# EAGLE design picopower (EAGLE 9.5.1)
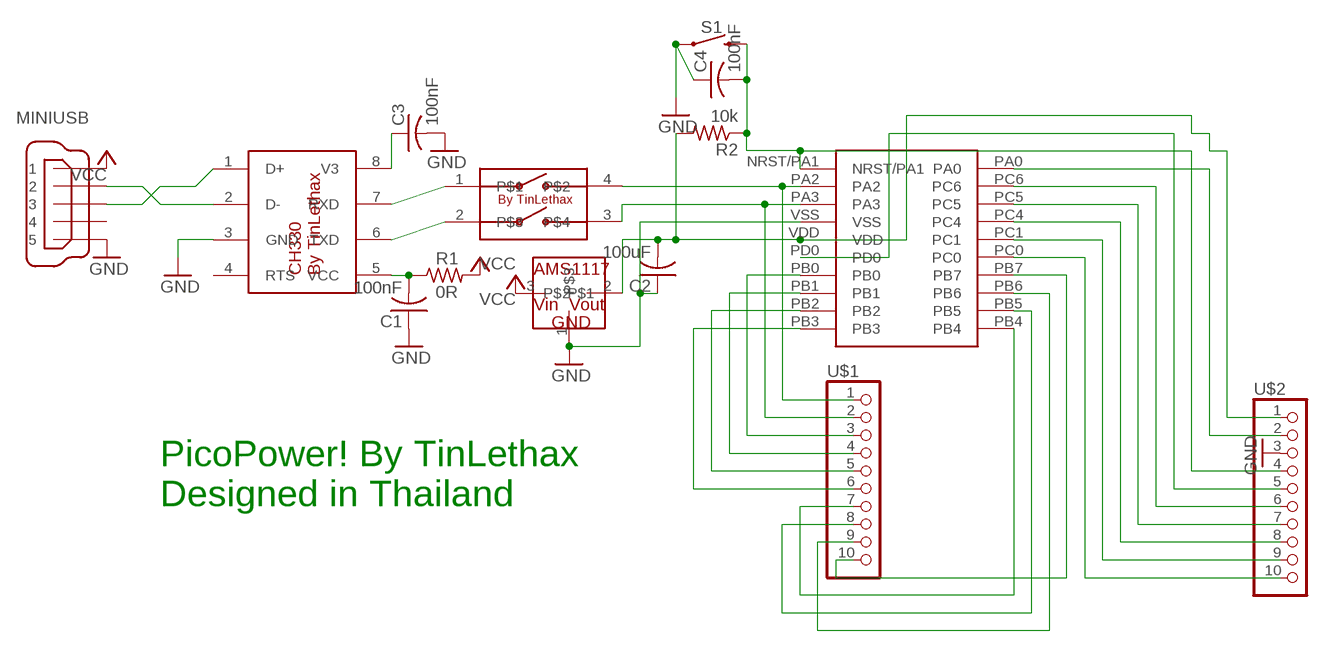
[diagram p0: schematic, sheet 1]

## Parts
2DIP  2DIPSWITCH  [SOIC127P835X230-4N]
C1  100nF  C-USC0603K  [C0603K]
C2  100uF  C-USC0603K  [C0603K]
C3  100nF  C-USC0603K  [C0603K]
C4  100nF  C-USC0603K  [C0603K]
CH330  CH330  [SOIC127P600X150-8N]
MINIUSB  MINI-USB-UX60A-MB-5ST  [UX60A-MB-5ST]
R1  0R  R-US_R0603  [R0603]
R2  10k  R-US_R0603  [R0603]
S1  MOMENTARY-SWITCH-SPST-SMD-6.0X3.5MM  [TACTILE_SWITCH_SMD_6.0X3.5MM]
STM8L  STM8L151F3  [UFQFPN-20]
U$1  PINHD-1X10  [1X10-BIG]
U$2  PINHD-1X10  [1X10-BIG]
U$3  AMS1117  [SOT223]

## Nets
GND: C1.1 C2.1 C3.2 C4.1 CH330.3(GND) MINIUSB.5 S1.1 STM8L.VSS U$2.3 U$3.1
N$1: 2DIP.1 CH330.7(RXD)
N$2: 2DIP.2 CH330.6(TXD)
N$3: 2DIP.4 STM8L.PA2 U$1.1
N$4: 2DIP.3 STM8L.PA3 U$1.2
N$5: C1.2 CH330.5(VCC) R1.1
N$6: C3.1 CH330.8(V3)
N$7: C2.2 R2.2 STM8L.VDD U$2.1 U$3.2
N$8: STM8L.PB0 U$1.3
N$9: STM8L.PB1 U$1.4
N$10: STM8L.PB2 U$1.5
N$11: STM8L.PB3 U$1.6
N$12: STM8L.PB4 U$1.7
N$13: STM8L.PB5 U$1.8
N$14: STM8L.PB6 U$1.9
N$15: STM8L.PB7 U$1.10
N$16: STM8L.PC0 U$2.10
N$17: STM8L.PC1 U$2.9
N$18: STM8L.PC4 U$2.8
N$19: STM8L.PC5 U$2.7
N$20: STM8L.PC6 U$2.6
N$21: CH330.2(D-) MINIUSB.2
N$22: C4.2 R2.1 S1.2 STM8L.NRST/PA1 U$2.4
N$23: STM8L.PA0 U$2.2
N$24: STM8L.PD0 U$2.5
N$25: CH330.1(D+) MINIUSB.3
VCC: MINIUSB.1 R1.2 U$3.3
Unconnected: CH330.4(RTS) MINIUSB.4

## Notes on the sheet
- PicoPower! By TinLethax
  Designed in Thailand

## Library data of the parts
2DIP = KE_DIP_SWITCH_2:2DIPSWITCH: Shenzhen Ke Rotary Dip Switch (x2); PACKAGE: SOP4
C1-C4 = adafruit:C-US: CAPACITOR, American symbol
CH330 = CH330:CH330: CH330 Super small Serial to USB chip; DESCRIPTION: CH330 Super small Serial to USB chip; PACKAGE: SOP8; PARTNO: CH330
MINIUSB = con-hirose:MINI-USB-: MINI USB Connector Source: http://www.hirose.co.jp/cataloge_hp/e24000019.pdf; OC_FARNELL: unknown; OC_NEWARK: unknown
R1 R2 = adafruit:R-US_: RESISTOR, American symbol
S1 = SparkFun-Switches:MOMENTARY-SWITCH-SPST: Momentary Switch (Pushbutton) - SPST Normally-open (NO) SPST momentary switches (buttons, pushbuttons). Variants PTH-12MM - 12mm square, through-hole Momentary Pushbutton Switch - 12mm Square <https://www.sparkfun.com/products/9190> (COM-09190) PTH-6.0MM, PTH-6.0MM-KIT - 6.0mm square, through-hole Mini Pushbutton Switch <https://www.sparkfun.com/products/97> (COM-00097) KIT package intended for soldering kit's - only one side of pads' copper is exposed. PTH-RIGHT-ANGLE-KIT - Right-angle, through-hole Right Angle Tactile Button <https://www.sparkfun.com/products/10791> - Used on SparkFun BigTime Watch Kit <https://www.sparkfun.com/products/11734> SMD-12MM - 12mm square, surface-mount Tactile Button - SMD (12mm) <https://www.sparkfun.com/products/12993> (COM-12993) Used on SparkFun PicoBoard <https://www.sparkfun.com/products/11888> SMD-4.5MM - 4.5mm Square Trackball Switch Used on SparkFun Blackberry Trackballer Breakout <https://www.sparkfun.com/products/13169> SMD-4.6MMX2.8MM - 4.60mm x 2.80mm, surface mount Used on SparkFun SAMD21 Mini Breakout <https://www.sparkfun.com/products/13664> SMD-5.2MM, SMD-5.2-REDUNDANT - 5.2mm square, surface-mount Mini Pushbutton Switch - SMD <https://www.sparkfun.com/products/8720> (COM-08720) Used on Arduino Pro Mini <https://www.sparkfun.com/products/11114> REDUNDANT package connects both switch circuits together SMD-6.0X3.5MM - 6.0 x 3.5mm, surface mount Momentary Reset Switch SMD <https://www.sparkfun.com/products/8229> (COM-08229) SMD-6.2MM-TALL - 6.2mm square, surface mount Tactile Button - SMD (6mm) <https://www.sparkfun.com/products/12992> Used on SparkFun Digital Sandbox <https://www.sparkfun.com/products/12651> SMD-RIGHT-ANGLE - Right-angle, surface mount Used on SparkFun Block for Intel® Edison - Arduino <https://www.sparkfun.com/products/13036>; PROD_ID: SWCH-00815; SF_SKU: COM-08229
STM8L = STM8L151F3:STM8L151F3: STM8L151F3 8bit mcuwith the 3x3 mm size !
U$1 U$2 = adafruit:PINHD-1X10: Pin header 1x10 0.1" spacing With round pins
U$3 = AMS1117:AMS1117: The The AMS1117 series of adjustable and fixed voltage regulators are designed to provide up to1A output current and to operate down to 1V input-to-output differential. The dropout voltage of the device is guaranteed maximum 1.3V, decreasing at lower load currents.; PARTNO: AMS1117

## Board
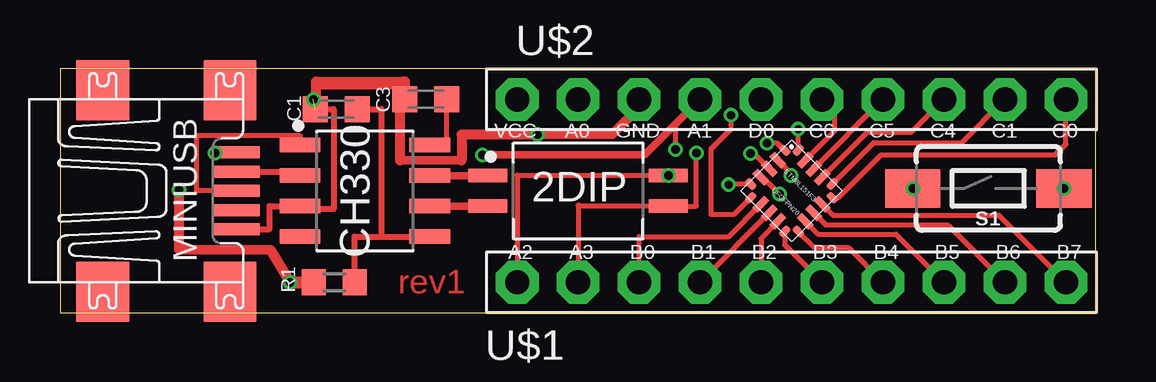
[diagram p1: board, top side]
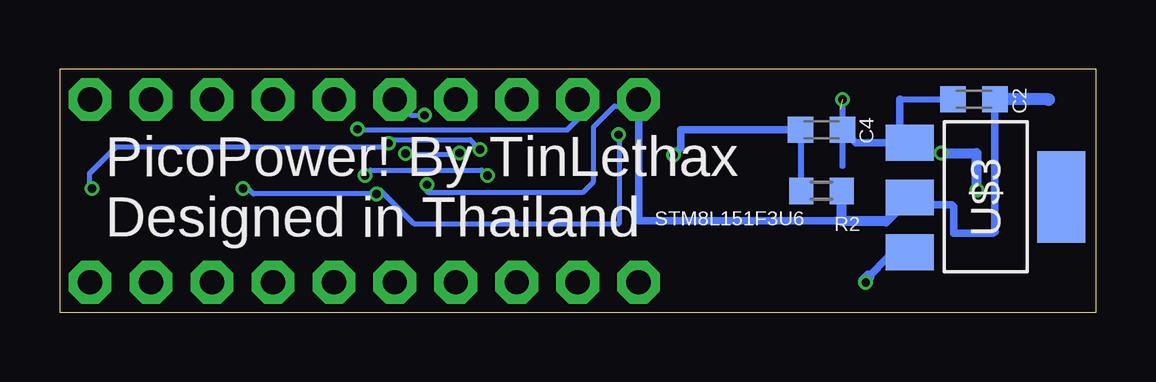
[diagram p2: board, bottom side, seen from below]

Size 43.16 x 10.16 mm. Coordinates in mm from the lower left corner, seen from the top.
Outline: 0,0 43.16,0 43.16,10.16 0,10.16 0,0
Copper layers (1*16): Top 0.035559375mm / dielectric 1.6mm / Bottom 0.035559375mm
Design rules "oshpark-2layer": minimum track width 6mil, minimum drill 10mil, track to track 6mil, track to pad 6mil, pad to pad 6mil, via to via 6mil, smd to smd 6mil, copper to edge 15mil, drill to drill 6mil, minimum pad ring 5mil, minimum via ring 5mil, stop-mask expansion 2.5mil, vias tented up to drill 0mil, thermal gap 10mil

### Footprints (pad centres in the part's own frame; a part is rotated, then mirrored left to right if it is on the bottom)
SOIC127P835X230-4N = smd 1.625 x 0.572: 1 -3.763,0.635; 2 -3.763,-0.635; 3 3.763,-0.635; 4 3.763,0.635
C0603K = smd 1.05 x 1.08: 1 -0.875,0; 2 0.875,0
SOIC127P600X150-8N = smd 1.708 x 0.602: 1 -2.7,1.905; 2 -2.7,0.635; 3 -2.7,-0.635; 4 -2.7,-1.905; 5 2.7,-1.905; 6 2.7,-0.635; 7 2.7,0.635; 8 2.7,1.905
UX60A-MB-5ST = smd 2 x 0.5: 1 2.25,1.6; 2 2.25,0.8; 3 2.25,0; 4 2.25,-0.8; 5 2.25,-1.6 | smd 2.2 x 2.5: M1 -3.3,-4.2; M2 -3.3,4.2; M3 2,4.2; M4 2,-4.2
R0603 = smd 1 x 1.1: 1 -0.85,0; 2 0.85,0
TACTILE_SWITCH_SMD_6.0X3.5MM = smd 2.3 x 1.6: 1 -3.15,0; 2 3.15,0
UFQFPN-20 = smd 0.5 x 0.3: NRST/PA1 -1.4,1; PB4 1.4,-1; PC0 1.4,1; VDD -1.4,-1 | smd 0.3 x 0.5: PA0 -1,1.4; PB3 1,-1.4; PC1 1,1.4; PD0 -1,-1.4 | smd 0.7 x 0.3: PA2 -1.3,0.5; PA3 -1.3,0; PB5 1.3,-0.5; PB6 1.3,0; PB7 1.3,0.5; VSS -1.3,-0.5 | smd 0.3 x 0.7: PB0 -0.5,-1.3; PB1 0,-1.3; PB2 0.5,-1.3; PC4 0.5,1.3; PC5 0,1.3; PC6 -0.5,1.3
1X10-BIG = drill 1.016 pad 1.778 octagon: 1 -11.43,0; 2 -8.89,0; 3 -6.35,0; 4 -3.81,0; 5 -1.27,0; 6 1.27,0; 7 3.81,0; 8 6.35,0; 9 8.89,0; 10 11.43,0
SOT223 = smd 1.499 x 2.007: 1 -2.261,-3.15; 2 0.025,-3.15; 3 2.311,-3.15 | smd 3.81 x 2.007: 4 0,3.15

### Placement (x,y rotation side)
2DIP  21.59,5.08 0 top
C1  11.51,8.48 0 top
C2  5.08,8.89 0 bottom
C3  15.24,8.89 180 top
C4  11.43,7.62 180 bottom
CH330  12.7,5.08 0 top
MINIUSB  5.08,5.08 0 top
R1  11.43,1.27 180 top
R2  11.43,5.08 0 bottom
S1  38.68,5.18 0 top
STM8L  30.48,5.08 315 top
U$1  30.48,1.27 0 top
U$2  30.48,8.89 0 top
U$3  4.6,4.83 270 bottom

### Tracks (layer width: path | path; a pad name or v marks a point on that pad's centre or on a via)
GND  (via drill 0.35)  (1 unrouted)
  Top 0.203: C1.1 10.66,8.51 | v29.97,4.95 29.28,5.65 STM8L.VSS
  Top 0.254: MINIUSB.5 8.74,3.48 8.74,4.45 CH330.3 10,4.32 11.41,4.32 11.41,8.48 C1.1
  Top 0.305: 14.28,9.63 14.1,9.45 10.63,9.45 C1.1
  Top 0.356: 16.74,6.35 14.17,6.35
  Top 0.406: 10.66,8.51 10.66,9.63 14.28,9.63 14.37,9.63 C3.2 14.17,8.7 14.17,6.35 | U$2.3 24.13,8.56 23.01,7.44 19.91,7.44 v19.89,7.42 16.74,7.42 16.74,6.35
  Bottom 0.203: 24.13,3.78 24.21,3.71 | 24.21,3.71 28.42,3.71 29.82,5.11 v29.97,4.95 35.1,4.95 35.33,5.18 S1.1 | 24.21,3.71 19.86,3.71 19.86,7.39 v19.89,7.42
  Bottom 0.254: 8.18,8.89 C2.1 | v10.55,8.89 10.55,8.94 10.54,8.94 C4.1 10.55,6.12
  Bottom 0.305: 8.18,8.89 8.18,7.52 U$3.1 10.01,7.09 C4.1
  other vias: 35.53,5.18
N$1
  Top 0.305: CH330.7 2DIP.1
N$2
  Top 0.305: CH330.6 2DIP.2
N$3  (via drill 0.35)
  Top 0.203: v25.35,5.71 19.07,5.71 19.05,5.74 U$1.1 | STM8L.PA2 30.45,5.82 30.51,5.82 30.51,5.77 v30.45,5.71
  Bottom 0.203: v30.45,5.71 30.23,5.94 25.58,5.94 v25.35,5.71
N$4  (via drill 0.35)
  Top 0.203: U$1.2 21.59,4.47 21.62,4.5 21.67,4.45 2DIP.3 26.52,4.45 v26.52,6.65 | v28.77,6.64 28.82,6.69 28.87,6.69 STM8L.PA3
  Bottom 0.203: v28.77,6.64 28.77,6.6 26.57,6.6 v26.52,6.65
N$5
  Top 0.254: R1.1 12.28,3.18 CH330.5 13.39,3.18 13.39,8.48 C1.2
N$6
  Top 0.203: CH330.8 16.12,6.99 C3.1
N$7  (via drill 0.35)
  Top 0.203: STM8L.VDD 27.89,5.36 v27.86,5.33
  Bottom 0.203: v27.86,5.33 27.86,5.03 21.36,5.03 20.93,5.46 20.93,7.75 20.07,8.61 19.15,8.61 19.05,8.71
  Bottom 0.305: R2.2 10.59,5.08 10.59,3.84 19.05,3.84 19.05,8.71 U$2.1 | C2.2 4.21,3.39 | 4.21,3.39 4.19,3.38 | U$3.2 7.44,4.5 5.99,4.5 5.92,4.42 5.92,3.3 4.29,3.3 4.21,3.39
  Bottom 0.406: U$3.2 8.74,3.81 10.58,3.81 R2.2
  Bottom 0.508: 1.98,8.87 1.96,8.89 C2.2
N$8
  Top 0.203: U$1.3 24.13,3.18 27.87,3.18 STM8L.PB0
N$9
  Top 0.203: U$1.4 STM8L.PB1
N$10
  Top 0.203: STM8L.PB2 29.21,3.1 U$1.5
N$11
  Top 0.203: STM8L.PB3 30.2,2.82 U$1.6
N$12
  Top 0.203: STM8L.PB4 31.43,2.72 32.84,2.72 U$1.7
N$13
  Top 0.203: STM8L.PB5 31.58,3.28 34.82,3.28 U$1.8
N$14
  Top 0.203: STM8L.PB6 31.9,3.66 36.98,3.66 U$1.9
N$15
  Top 0.203: STM8L.PB7 32.2,4.06 39.12,4.06 U$1.10
N$16
  Top 0.203: STM8L.PC0 32.43,4.8 34.21,6.58 41.48,6.58 41.91,7.01 U$2.10
N$17
  Top 0.203: STM8L.PC1 33.9,7.09 37.57,7.09 U$2.9
N$18
  Top 0.203: STM8L.PC4 33.63,7.52 35.46,7.52 U$2.8
N$19
  Top 0.203: STM8L.PC5 U$2.7
N$20
  Top 0.203: STM8L.PC6 32.28,7.59 32.28,8.36 U$2.6
N$21
  Top 0.254: MINIUSB.2 10,5.88 CH330.2
N$22  (via drill 0.35)
  Top 0.203: U$2.4 25.63,7.85 25.63,6.83 v25.65,6.81 | 29.94,7.04 STM8L.NRST/PA1 30.2,6.77 30.2,6.75 29.9,7.06 v29.46,7.06
  Top 0.305: v17.6,6.58 24.36,6.58 U$2.4
  Bottom 0.203: S1.2 41.91,5.11 41.93,5.11 41.93,5.79 40.82,6.91 29.34,6.91 29.48,7.05 v29.46,7.06 29.31,7.21 26.06,7.21 v25.65,6.81
  Bottom 0.254: C4.2 12.3,5.08 R2.1
  Bottom 0.305: C4.2 17.3,7.62 17.3,6.88 v17.6,6.58
  other vias: 41.83,5.18
N$23  (via drill 0.35)
  Top 0.203: STM8L.PA0 v30.76,7.64
  Bottom 0.203: v30.76,7.64 30.76,7.62 22.02,7.62 21.59,8.05 U$2.2
N$24  (via drill 0.35)
  Top 0.203: STM8L.PD0 28.07,4.09 27.13,4.09 27.13,6.83 27.97,7.67 v27.97,8.23
  Bottom 0.203: U$2.5 28.55,8.23 v27.97,8.23
N$25
  Top 0.203: MINIUSB.3 5.69,5.08 5.69,7.39 10,7.39 CH330.1
VCC  (via drill 0.35)
  Top 0.203: 4.95,2.64 5.13,2.64
  Top 0.254: v6.45,6.65 7.3,6.65 MINIUSB.1
  Top 0.406: v4.95,5.11 4.95,2.64 | 5.13,2.64 8.76,2.62 v9.59,1.26
  Top 0.508: v9.59,1.26 v9.6,1.27 R1.2
  Bottom 0.203: 4.98,5.11 v4.95,5.11
  Bottom 0.305: U$3.3 8.46,2.52 9.65,1.32
  Bottom 0.406: v6.45,6.65 4.98,6.65 4.98,5.11
  Bottom 0.508: 9.47,1.5 9.65,1.32 v9.59,1.26

### Text on the board
Top: rev1
tNames: VCC | A0 | GND | A1 | D0 | C6 | C5 | C4 | C1 | C0 | A2 | A3 | B0 | B1 | B2 | B3 | B4 | B5 | B6 | B7
bNames: STM8L151F3U6 | PicoPower! By TinLethax / Designed in Thailand